# Altium project eecs373_driver_board_rev1.PrjPcb
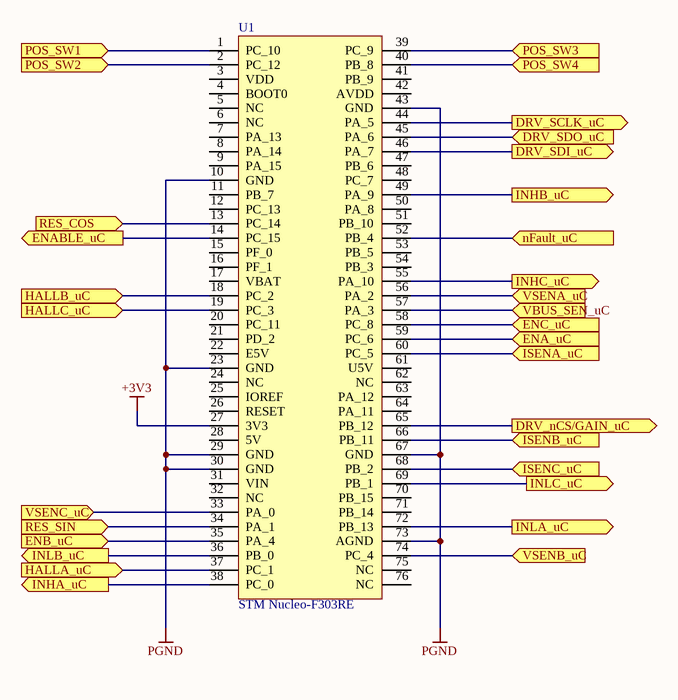
[diagram p0: 02-Nucleo_Breakout.SchDoc]
3 sheets, 107 parts. Net scope: hierarchical (ports join the sheet entries above them; power ports are global).
Board file: Driver_Board.PcbDoc
Sheets:
  02-Nucleo_Breakout.SchDoc
  03-Gate_Driver.SchDoc
  04-Power_Stage.SchDoc

## Sheet 02-Nucleo_Breakout.SchDoc
size B

### Parts
U1  STM Nucleo-F303RE  [Nucleo MORPHO CONNECTORS]

### Ports
DRV_nCS/GAIN_uC (out), DRV_SCLK_uC (out), DRV_SDI_uC (out), DRV_SDO_uC (in), ENA_uC (in), ENABLE_uC (out), ENB_uC (in), ENC_uC (in), HALLA_uC (in), HALLB_uC (in), HALLC_uC (in), INHA_uC (out), INHB_uC (out), INHC_uC (out), INLA_uC (out), INLB_uC (out), INLC_uC (out), ISENA_uC (in), ISENB_uC (in), ISENC_uC (in), nFault_uC (in), POS_SW1 (in), POS_SW2 (in), POS_SW3 (in), POS_SW4 (in), RES_COS (in), RES_SIN (in), VBUS_SEN_uC (in), VSENA_uC (in), VSENB_uC (in), VSENC_uC (in)

### Nets
+3V3: U1.27(3V3)  [project net VREF]
PGND: U1.10(GND) U1.23(GND) U1.29(GND) U1.30(GND) U1.43(GND) U1.67(GND) U1.73(AGND)
NetU1_1: U1.1(PC_10) ; port POS_SW1
NetU1_2: U1.2(PC_12) ; port POS_SW2
NetU1_13: U1.13(PC_14) ; port RES_COS
NetU1_14: U1.14(PC_15) ; port ENABLE_uC
NetU1_18: U1.18(PC_2) ; port HALLB_uC
NetU1_19: U1.19(PC_3) ; port HALLC_uC
NetU1_33: U1.33(PA_0) ; port VSENC_uC
NetU1_34: U1.34(PA_1) ; port RES_SIN
NetU1_35: U1.35(PA_4) ; port ENB_uC
NetU1_36: U1.36(PB_0) ; port INLB_uC
NetU1_37: U1.37(PC_1) ; port HALLA_uC
NetU1_38: U1.38(PC_0) ; port INHA_uC
NetU1_39: U1.39(PC_9) ; port POS_SW3
NetU1_40: U1.40(PB_8) ; port POS_SW4
NetU1_44: U1.44(PA_5) ; port DRV_SCLK_uC
NetU1_45: U1.45(PA_6) ; port DRV_SDO_uC
NetU1_46: U1.46(PA_7) ; port DRV_SDI_uC
NetU1_49: U1.49(PA_9) ; port INHB_uC
NetU1_52: U1.52(PB_4) ; port nFault_uC
NetU1_55: U1.55(PA_10) ; port INHC_uC
NetU1_56: U1.56(PA_2) ; port VSENA_uC
NetU1_57: U1.57(PA_3) ; port VBUS_SEN_uC
NetU1_58: U1.58(PC_8) ; port ENC_uC
NetU1_59: U1.59(PC_6) ; port ENA_uC
NetU1_60: U1.60(PC_5) ; port ISENA_uC
NetU1_65: U1.65(PB_12) ; port DRV_nCS/GAIN_uC
NetU1_66: U1.66(PB_11) ; port ISENB_uC
NetU1_68: U1.68(PB_2) ; port ISENC_uC
NetU1_69: U1.69(PB_1) ; port INLC_uC
NetU1_72: U1.72(PB_13) ; port INLA_uC
NetU1_74: U1.74(PC_4) ; port VSENB_uC

Not connected (* = marked no-connect by the designer): U1 3(VDD) 4(BOOT0) 5(NC) 6(NC) 7(PA_13) 8(PA_14) 9(PA_15) 11(PB_7) 12(PC_13) 15(PF_0) 16(PF_1) 17(VBAT) 20(PC_11) 21(PD_2) 22(E5V) 24(NC) 25(IOREF) 26(RESET) 28(5V) 31(VIN) 32(NC) 41(PB_9) 42(AVDD) 47(PB_6) 48(PC_7) 50(PA_8) 51(PB_10) 53(PB_5) 54(PB_3) 61(U5V) 62(NC) 63(PA_12) 64(PA_11) 70(PB_15) 71(PB_14) 75(NC) 76(NC)

## Sheet 03-Gate_Driver.SchDoc
size B
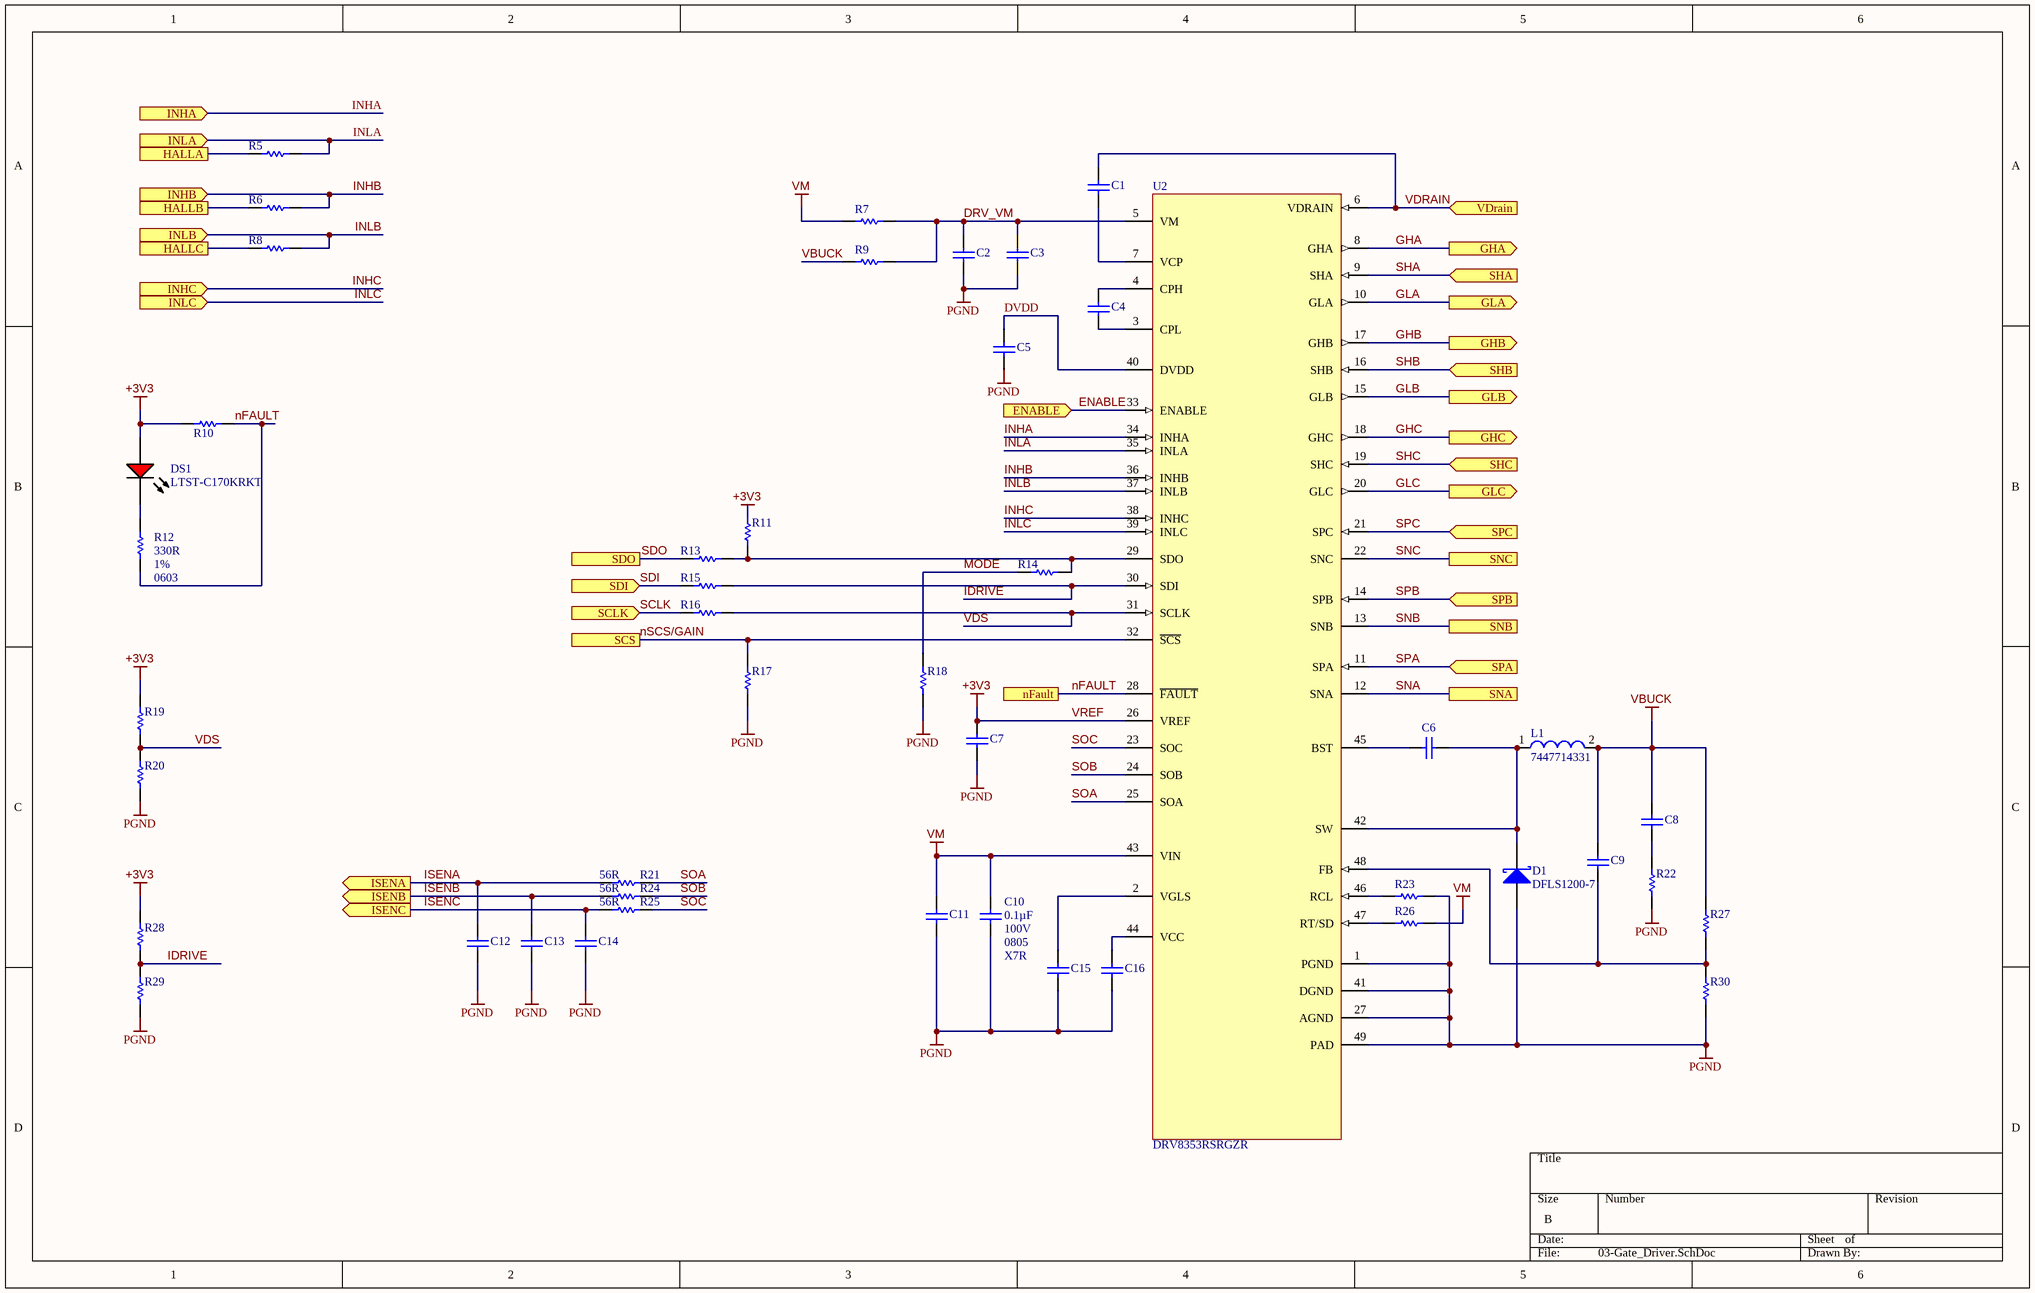
[diagram p1: 03-Gate_Driver.SchDoc]

### Parts
C1  GRM31CR72A105KA01L  [CAPC3216X180X55ML20T25]  (value not drawn)
C2  C5750X7S2A106M230KB  [TDK-C5750-2_L]  (value not drawn)
C3  C2012X7R2A104K125AA  [CAPC2013X145X20ML20]  (value not drawn)
C4  C0805C473K1RACTU  [CAPC2013X110X50LL20T25]  (value not drawn)
C5  C0603C105K4RACTU  [CAPC1608X90X35LL15T15]  (value not drawn)
C6  C0603C103K4RACTU  [CAPC1608X87X35ML15T15]  (value not drawn)
C7  C0603C104J4RACTU  [CAPC1608X87X35NL15T15]  (value not drawn)
C8  C2012X7R1H225K125AC  [CAPC2013X145X20LL20]  (value not drawn)
C9  GRM1885C1H362JA01D  [CAPC1608X90X35ML10T15]  (value not drawn)
C10  Temperature Coefficient: X7R  Voltage - Rated: 100V  Package Reference: 0805  Capacitance: 0.1µF  [CAPC2013X145X20ML20]  (hidden comment: C2012X7R2A104K125AA)
C11  C3216X7R2A105K160AA  [CAPC3216X180X20LL20]  (value not drawn)
C12  GRM188R71C222KA01D  [CAPC1608X90X35NL10T15]  (value not drawn)
C13  GRM188R71C222KA01D  [CAPC1608X90X35NL10T15]  (value not drawn)
C14  GRM188R71C222KA01D  [CAPC1608X90X35NL10T15]  (value not drawn)
C15  C0805C105K3RACTU  [CAPC2013X140X50LL20T25]  (value not drawn)
C16  C0603C105K4RACTU  [CAPC1608X90X35LL15T15]  (value not drawn)
D1  DFLS1200-7  [DIOD-POWERDI123-2_A_V]
DS1  LTST-C170KRKT  [LTST-C170KRKT_V]
L1  7447714331  [WE-PD 1050]
R5  ERJ-3GEY0R00V  [RESC1608X55X30NL15T15]  (value not drawn)
R6  ERJ-3GEY0R00V  [RESC1608X55X30NL15T15]  (value not drawn)
R7  ERJ-3GEY0R00V  [RESC1608X55X30NL15T15]  (value not drawn)
R8  ERJ-3GEY0R00V  [RESC1608X55X30NL15T15]  (value not drawn)
R9  ERJ-3GEY0R00V  [RESC1608X55X30NL15T15]  (value not drawn)
R10  RG1608P-103-B-T5  [RESC1608X50X30NL20T20]  (value not drawn)
R11  ERJ-3GEYJ102V  [RESC1608X55X30ML15T15]  (value not drawn)
R12  Case Code (Imperial): 0603  Tolerance: 1%  Resistance: 330R  [RESC1608X55X30NL15T15]  (hidden comment: ERJ3EKF3300V)
R13  ERJ-3GEY0R00V  [RESC1608X55X30NL15T15]  (value not drawn)
R14  ERJ-3GEY0R00V  [RESC1608X55X30NL15T15]  (value not drawn)
R15  ERJ-3GEY0R00V  [RESC1608X55X30NL15T15]  (value not drawn)
R16  ERJ-3GEY0R00V  [RESC1608X55X30NL15T15]  (value not drawn)
R17  CRCW060347K0JNEA  [RESC1609X50X30ML10T20]  (value not drawn)
R18  CRCW060347K0JNEA  [RESC1609X50X30ML10T20]  (value not drawn)
R19  CRCW060375K0JNEA  [RESC1609X50X30ML10T20]  (value not drawn)
R20  CRCW060375K0JNEA  [RESC1609X50X30ML10T20]  (value not drawn)
R21  Resistance: 56R  [RESC1609X50X30ML10T20]  (hidden comment: CRCW060356R0FKEA)
R22  2R61 1% 0603(1608)  [RESC0603(1608)_N]  (value not drawn)
R23  CRCW0603107KFKEA  [RESC1609X50X30LL10T20]  (value not drawn)
R24  Resistance: 56R  [RESC1609X50X30ML10T20]  (hidden comment: CRCW060356R0FKEA)
R25  Resistance: 56R  [RESC1609X50X30ML10T20]  (hidden comment: CRCW060356R0FKEA)
R26  ERJ-3EKF2743V  [RESC1608X55X30NL15T15]  (value not drawn)
R27  RG1608P-103-B-T5  [RESC1608X50X30NL20T20]  (value not drawn)
R28  CRCW060375K0JNEA  [RESC1609X50X30ML10T20]  (value not drawn)
R29  CRCW060375K0JNEA  [RESC1609X50X30ML10T20]  (value not drawn)
R30  RG1608P-2611-B-T5  [RESC1608X50X30NL20T20]  (value not drawn)
U2  DRV8353RSRGZR  [DRV8353RS]

### Ports
ENABLE (in), GHA (out), GHB (out), GHC (out), GLA (out), GLB (out), GLC (out), HALLA, HALLB, HALLC, INHA (in), INHB (in), INHC (in), INLA (in), INLB (in), INLC (in), ISENA (out), ISENB (out), ISENC (out), nFault, SCLK (in), SCS, SDI (in), SDO, SHA (in), SHB (in), SHC (in), SNA, SNB, SNC, SPA (in), SPB (in), SPC (in), VDrain (in)

### Nets
PGND: C2.1 C3.1 C5.1 C7.1 C10.1 C11.1 C12.1 C13.1 C14.1 C15.1 C16.1 D1.1(A) R17.1 R18.1 R20.2 R22.1 R23.2 R29.2 R30.1 U2.1(PGND) U2.27(AGND) U2.41(DGND) U2.49(PAD)
VBUCK: C8.2 C9.2 L1.2 R9.1 R27.2
VM: C10.2 C11.2 R7.1 R26.2 U2.43(VIN)
VREF: C7.2 DS1.1(A) R10.2 R11.2 R19.1 R28.1 U2.26(VREF)  [also labelled +3V3]
DRV_VM: C2.2 C3.2 R7.2 R9.2 U2.5(VM)
DVDD: C5.2 U2.40(DVDD)
ENABLE: U2.33(ENABLE) ; port ENABLE
GHA: U2.8(GHA) ; port GHA
GHB: U2.17(GHB) ; port GHB
GHC: U2.18(GHC) ; port GHC
GLA: U2.10(GLA) ; port GLA
GLB: U2.15(GLB) ; port GLB
GLC: U2.20(GLC) ; port GLC
IDRIVE: R15.2 R28.2 R29.1 U2.30(SDI)
INHA: U2.34(INHA) ; port INHA
INHB: R6.2 U2.36(INHB) ; port INHB
INHC: U2.38(INHC) ; port INHC
INLA: R5.2 U2.35(INLA) ; port INLA
INLB: R8.2 U2.37(INLB) ; port INLB
INLC: U2.39(INLC) ; port INLC
ISENA: C12.2 R21.1 ; port ISENA
ISENB: C13.2 R24.1 ; port ISENB
ISENC: C14.2 R25.1 ; port ISENC
MODE: R14.1 R18.2
nFAULT: R10.1 R12.1 U2.28(~{FAULT}) ; port nFault
nSCS/GAIN: R17.2 U2.32(~{SCS}) ; port SCS
SCLK: R16.1 ; port SCLK
SDI: R15.1 ; port SDI
SDO: R13.1 ; port SDO
SHA: U2.9(SHA) ; port SHA
SHB: U2.16(SHB) ; port SHB
SHC: U2.19(SHC) ; port SHC
SNA: U2.12(SNA) ; port SNA
SNB: U2.13(SNB) ; port SNB
SNC: U2.22(SNC) ; port SNC
SOA: R21.2 U2.25(SOA)
SOB: R24.2 U2.24(SOB)
SOC: R25.2 U2.23(SOC)
SPA: U2.11(SPA) ; port SPA
SPB: U2.14(SPB) ; port SPB
SPC: U2.21(SPC) ; port SPC
VDRAIN: C1.2 U2.6(VDRAIN) ; port VDrain
VDS: R16.2 R19.2 R20.1 U2.31(SCLK)
NetC1_1: C1.1 U2.7(VCP)
NetC4_1: C4.1 U2.3(CPL)
NetC4_2: C4.2 U2.4(CPH)
NetC6_1: C6.1 U2.45(BST)
NetC6_2: C6.2 D1.2(K) L1.1 U2.42(SW)
NetC8_1: C8.1 R22.2
NetC9_1: C9.1 R27.1 R30.2 U2.48(FB)
NetC15_2: C15.2 U2.2(VGLS)
NetC16_2: C16.2 U2.44(VCC)
NetDS1_2: DS1.2(K) R12.2
NetR5_1: R5.1 ; port HALLA
NetR6_1: R6.1 ; port HALLB
NetR8_1: R8.1 ; port HALLC
NetR11_1: R11.1 R13.2 R14.2 U2.29(SDO)
NetR23_1: R23.1 U2.46(RCL)
NetR26_1: R26.1 U2.47(RT/SD)

### Library data of the parts
C1 = CMP-2000-04948-1: Chip Capacitor, 1 uF, +/- 10%, 100 V, -55 to 125 degC, 1206 (3216 Metric), RoHS, Tape and Reel; Manufacturer: Murata; Catalog Drawings: GRMSeries_1206_1.6; Featured Product: GA3SafetyRecognizedCapsandHi-CapMLCC; Online Catalog: GRMSeries; Temperature Coefficient: X7R; Product Training Modules: High-CapMultilayerCeramicCapacitors; Other Names: 490-3909-6; Voltage - Rated: 100V; Capacitance: 1µF; Thickness (Max): 0.071"(1.80mm); Height - Seated (Max): -; Features: -; Applications: GeneralPurpose; Manufacturer URL: http://www.murata.com/; Standard Package: 1; Size / Dimension: 0.126"Lx0.063"W(3.20mmx1.60mm); Package Reference: 1206; Series: GRM; Package / Case: 1206(3216Metric); Datasheet Version: Sep-11; Ratings: -; Category: Capacitors; Datasheet URL: https://datasheet.ciiva.com/29199/454987-da-01-en-vs-kondensator-1206-29199435.pdf; Operating Temperature: -55degC~125degC; Lead Spacing: -; Family: CeramicCapacitors; Tolerance: ±10%; Packaging: Digi-Reel; Mounting Type: SurfaceMount,MLCC; Package Description: 2-Pin Surface Mount Device, Body 3.2 x 1.6 mm; Lead Style: -
C2 = CMP-2000-06059-1: Chip Capacitor, 10 uF, +/- 20%, 100 V, -55 to 125 degC, 2220 (5750 Metric), RoHS, Tape and Reel; PCN Part Number: MLCCPartNumberChange30/Nov/2012; Manufacturer: TDK; Other Names: 445-5212-1; Featured Product: Compact,High-CapacitanceMultilayerCeramicChipCapacitorsMidVoltageX7S-100VMLCCsC-SeriesMidVoltageMLCCs; Product Training Modules: SEAT,CCV,andTVCLDesignToolsCSeriesMidVoltageCapacitorsFamilyGuidetoReplacinganElectrolyticCapacitorwithanMLCC; Kits: 445-9009-KIT-ND-KITCAPCERHICAP100V-630VSMDSAMPLEKIT1008-ND-KITCAPCERMLCC100V-630V; Catalog Drawings: CSERIES_2220_2.5; Online Catalog: CSeries,MidVoltage; Temperature Coefficient: X7S; Voltage - Rated: 100V; Capacitance: 10µF; Package Description: SMD, 2-Leads, Body 6.1 x 5.4 mm; Manufacturer URL: http://www.tdk.com/; Size / Dimension: 0.224"Lx0.197"W(5.70mmx5.00mm); RoHS Information: RoHSCertificate-MLCC; Package Reference: C5750-2; Applications: GeneralPurpose; Datasheet Version: 09/2013; Features: -; Datasheet URL: https://datasheet.ciiva.com/24216/c5750x7s2a106m230kb-265716-24216594.pdf; Standard Package: 1; Lead Spacing: -; Family: CeramicCapacitors; Thickness (Max): 0.098"(2.50mm); Packaging: CutTape(CT); Mounting Technology: SurfaceMount; Lead Style: -; Height - Seated (Max): -; Package / Case: 2220(5750Metric); Series: C; Category: Capacitors; Ratings: -; Operating Temperature: -55°C~125°C; Mounting Type: SurfaceMount,MLCC; Tolerance: ±20%
C3 = CMP-2000-05453-1: Chip Capacitor, 100 nF, +/- 10%, 100 V, -55 to 1255 degC, 0805 (2012 Metric), RoHS, Tape and Reel; Manufacturer: TDK; PCN Part Number: MLCCPartNumberChange30/Nov/2012; Temperature Coefficient: X7R; Voltage - Rated: 100V; Kits: SAMPLEKIT1008-ND-KITCAPCERMLCC100V-630V; Other Names: 445-1418-1; Online Catalog: CSeries,MidVoltage; Featured Product: C-SeriesMidVoltageMLCCs; Catalog Drawings: CSERIES_2012-0805_1.45; Product Training Modules: HighCapacitanceReplacementSEAT,CCV,andTVCLDesignToolsGuidetoReplacinganElectrolyticCapacitorwithanMLCC; Capacitance: 0.1µF; Applications: GeneralPurpose; Datasheet Version: Jul-13; Mounting Type: SurfaceMount,MLCC; Height - Seated (Max): -; Packaging: CutTape(CT); Datasheet URL: https://datasheet.ciiva.com/11788/0900766b80fc5cba-11788142.pdf; Tolerance: ±10%; Package Reference: 805; Manufacturer URL: http://www.tdk.com/; Thickness (Max): 0.057"(1.45mm); Series: C; Lead Style: -; Operating Temperature: -55degC~125degC; Category: Capacitors; Package Description: 2-Pin Surface Mount Device, Body 2 x 1.25 mm; Standard Package: 1; Package / Case: 0805(2012Metric); Family: CeramicCapacitors; RoHS Information: RoHSCertificate-MLCC; Size / Dimension: 0.079"Lx0.049"W(2.00mmx1.25mm); Lead Spacing: -; Ratings: -; Features: -
C4 = CMP-2007-03657-1: Manufacturer: Kemet; Part Number: C0805C473K1RACTU
C5 C16 = CMP-2006-02240-1: Manufacturer: Kemet; Part Number: C0603C105K4RACTU
C6 = CMP-2006-03042-1: Manufacturer: Kemet; Part Number: C0603C103K4RACTU
C7 = CMP-2006-03054-1: Manufacturer: Kemet; Part Number: C0603C104J4RACTU
C8 = CMP-2000-06040-1: Chip Capacitor, 2.2 uF, +/- 10%, 50 V, -55 to 125 degC, 0805 (2012 Metric), RoHS, Tape and Reel; Manufacturer: TDK; PCN Part Number: MLCCPartNumberChange30/Nov/2012; Other Names: 445-5968-1; Temperature Coefficient: X7R; Catalog Drawings: CSERIES_2012-0805_1.45; Kits: 445-9015-KIT-ND-KITMLCC1000PF-47UF080510-50V445-9003-KIT-ND-KITCAPCERHICAPMLCCSMD445-173086-KIT-ND-C0402-2220X7R6.3-50V1,000PF-; Online Catalog: CSeries,GeneralPurpose; Voltage - Rated: 50V; Capacitance: 2.2µF; Product Training Modules: CSeriesGeneralApplicationsSEAT,CCV,andTVCLDesignToolsGuidetoReplacinganElectrolyticCapacitorwithanMLCC; Operating Temperature: -55°C~125°C; Features: -; Tolerance: ±10%; Datasheet URL: https://datasheet.ciiva.com/24216/c2012x7r1h225k125ac-265016-24216364.pdf; Lead Style: -; Size / Dimension: 0.079"Lx0.049"W(2.00mmx1.25mm); Mounting Technology: SurfaceMount; Package Reference: 0805; Thickness (Max): 0.057"(1.45mm); RoHS Information: RoHSCertificate-MLCC; Height - Seated (Max): -; Manufacturer URL: http://www.tdk.com/; Standard Package: 1; Category: Capacitors; Package Description: 2-Pin Surface Mount Device, Body 2 x 1.25 mm; Packaging: CutTape(CT); Series: C; Applications: GeneralPurpose; Package / Case: 0805(2012Metric); Ratings: -; Datasheet Version: 09/2013; Family: CeramicCapacitors; Mounting Type: SurfaceMount,MLCC; Lead Spacing: -
C9 = CMP-2006-02551-1: Manufacturer: Murata; Part Number: GRM1885C1H362JA01D
C10 = CMP-2000-05453-1: Chip Capacitor, 100 nF, +/- 10%, 100 V, -55 to 1255 degC, 0805 (2012 Metric), RoHS, Tape and Reel; Manufacturer: TDK; PCN Part Number: MLCCPartNumberChange30/Nov/2012; Kits: SAMPLEKIT1008-ND-KITCAPCERMLCC100V-630V; Other Names: 445-1418-1; Online Catalog: CSeries,MidVoltage; Featured Product: C-SeriesMidVoltageMLCCs; Catalog Drawings: CSERIES_2012-0805_1.45; Product Training Modules: HighCapacitanceReplacementSEAT,CCV,andTVCLDesignToolsGuidetoReplacinganElectrolyticCapacitorwithanMLCC; Applications: GeneralPurpose; Datasheet Version: Jul-13; Mounting Type: SurfaceMount,MLCC; Height - Seated (Max): -; Packaging: CutTape(CT); Datasheet URL: https://datasheet.ciiva.com/11788/0900766b80fc5cba-11788142.pdf; Tolerance: ±10%; Manufacturer URL: http://www.tdk.com/; Thickness (Max): 0.057"(1.45mm); Series: C; Lead Style: -; Operating Temperature: -55degC~125degC; Category: Capacitors; Package Description: 2-Pin Surface Mount Device, Body 2 x 1.25 mm; Standard Package: 1; Package / Case: 0805(2012Metric); Family: CeramicCapacitors; RoHS Information: RoHSCertificate-MLCC; Size / Dimension: 0.079"Lx0.049"W(2.00mmx1.25mm); Lead Spacing: -; Ratings: -; Features: -
C11 = CMP-2000-06049-1: Chip Capacitor, 1 uF, +/- 10%, 100 V, -55 to 125 degC, 1206 (3216 Metric), RoHS, Tape and Reel; Manufacturer: TDK; PCN Part Number: MLCCPartNumberChange30/Nov/2012; Kits: SAMPLEKIT1008-ND-KITCAPCERMLCC100V-630V; Product Training Modules: SEAT,CCV,andTVCLDesignToolsGuidetoReplacinganElectrolyticCapacitorwithanMLCC; Capacitance: 1µF; Featured Product: C-SeriesMidVoltageMLCCs; Voltage - Rated: 100V; Other Names: 445-4467-1; Catalog Drawings: CSERIES_1206_1.8; Online Catalog: CSeries,MidVoltage; Temperature Coefficient: X7R; Features: -; Family: CeramicCapacitors; Datasheet URL: http://www.farnell.com/datasheets/1484596.pdf; Mounting Technology: SurfaceMount; Mounting Type: SurfaceMount,MLCC; Datasheet Version: 08/2011; Standard Package: 1; Package / Case: 1206(3216Metric); Thickness (Max): 0.051"(1.30mm); Size / Dimension: 0.126"Lx0.063"W(3.20mmx1.60mm); Applications: GeneralPurpose; Package Reference: 1206; Operating Temperature: -55°C~125°C; Packaging: CutTape(CT); Package Description: 2-Pin Surface Mount Device, Body 3.2 x 1.6 mm; Ratings: -; Series: C; Tolerance: ±10%; Manufacturer URL: http://www.tdk.com/; Lead Spacing: -; Height - Seated (Max): -; Package URL: https://product.tdk.com/info/en/documents/chara_sheet/C3216X7R1V106K160AC.pdf; Lead Style: -; Category: Capacitors; RoHS Information: RoHSCertificate-MLCC
C12-C14 = CMP-2006-02517-1: Manufacturer: Murata; Part Number: GRM188R71C222KA01D
C15 = CMP-2007-03234-1: Manufacturer: Kemet; Part Number: C0805C105K3RACTU
D1 = CMP-2000-07540-1: High Voltage Schottky Barrier Rectifier, 200 V, 1 A, -65 to 175 degC, 2-Pin SMD, RoHS, Tape and Reel; Manufacturer: Diodes Inc; Peak Non-Repetitive Surge Current: 40A; Max Repetitive Reverse Voltage (Vrrm): 200V; Peak Reverse Current: 2uA; Capacitance: 23pF; Forward Current: 1A; Forward Voltage: 850mV; Element Configuration: Single; Polarity: Standard; Number of Pins: 2; Package Description: 2-Pin Small Outline Diode, Body 2.8 x 1.78 mm; Mount: SurfaceMount; Max Operating Temperature: 150degC; Package Quantity: 3000; Lead Free: LeadFree; Max Forward Surge Current (Ifsm): 40A; Height: 0.98mm; Datasheet Version: Rev. 6-2, 10/2008; Package Reference: POWERDI123-2_A; Reverse Voltage (DC): 200V; REACH SVHC: NoSVHC; Min Operating Temperature: -65degC; RoHSCompliant: true; Width: 1.78mm; Contact Plating: Matte; Termination: SMD/SMT; Manufacturer URL: http://www.diodes.com/; Voltage Rating (DC): 200V; Length: 2.8mm; Output Current: 1A; Packaging: TapeandReel; Current Rating: 1A; Radiation Hardening: No; Mounting Technology: SurfaceMount; Average Rectified Current: 1A; Datasheet URL: https://www.diodes.com/assets/Datasheets/ds30628.pdf
DS1 = CMP-2000-07593-1: LED Red, 75 mW, 54 mcd, -55 to 85 degC, 2-Pin SMD, RoHS, Tape and Reel; Manufacturer: Lite-On; Lens Transparency: Clear; Number of Elements: 1; Power Rating: 75mW; Luminous Intensity: 54mcd; Viewing Angle: 130degrees; Forward Current: 30mA; Wavelength: 639nm; Lens Style: Rectangular; Case\/Package: 0805; Test Current: 20mA; Dominant Wavelength: 631nm; Forward Voltage: 2V; Lens Colour: Colorless; Min Operating Temperature: -55degC; RoHSCompliant: True; Length: 3.2mm; Width: 1.25mm; Mount: SurfaceMount; Packaging: TapeandReel; Number of LEDs: 1; Radiation Hardening: No; Datasheet URL: http://optoelectronics.liteon.com/upload/download/DS-22-99-0150/LTST-C170KRKT.pdf; Datasheet Version: Rev. D, 11/2014; Case Code (Metric): 2012; Height: 1.1mm; Number of Pins: 2; Package Description: 2-Pin Surface Mount Device, Body 2 x 1.25 mm; Manufacturer URL: http://www.us.liteon.com/; Lead Free: LeadFree; Illumination Colour: Red; Colour: Red; Case Code (Imperial): 0805; Max Operating Temperature: 85degC; Power Dissipation: 75mW; Mounting Technology: SurfaceMount; Package Reference: C170KRKT; Package Quantity: 1; Depth: 1.6mm
L1 = CMP-1396-00019-1: SMD-Shielded Power Inductor WE-PD, L=330 µH; Manufacturer: Wuerth Elektronik; Inductance: 330 ÂµH; PackageReference: WE-PD 1050; ComponentLink1URL: http://www.we-online.com; ComponentLink1Description: Manufacturer URL; ComponentLink2Description: Datasheet; PartNumber: 7447714331; ComponentLink2URL: http://www.we-online.de/katalog/media/pdf/7447714331.pdf
R5-R9 R13-R16 = CMP-2000-00700-1: Manufacturer: Panasonic; Part Number: ERJ-3GEY0R00V
R10 R27 = CMP-2000-01968-1: Manufacturer: Susumu; Part Number: RG1608P-103-B-T5
R11 = CMP-2000-00703-1: Manufacturer: Panasonic; Part Number: ERJ-3GEYJ102V
R12 = CMP-2000-00435-1: Manufacturer: Panasonic; Power Rating: 100mW; Voltage Rating: 75V; Temperature Coefficient: 100ppm/°C; Part Number: ERJ3EKF3300V; Supplier 1: Newark; Supplier Part Number 1: 85Y8676; Manufacturer Part Number: ERJ3EKF3300V; Stock 1: 0; RoHS: Yes; Mount: Surface Mount; Case/Package: 0603; Number of Pins: 2; Weight: 7.1E-05oz; Case Code (Metric): 1608; Contact Plating: Tin; Min Operating Temperature: -55°C; Max Operating Temperature: 155°C; Packaging: Tape and Reel; Composition: Thick Film; Package Quantity: 5000; Military Standard: Not; Termination: SMD/SMT; Number of Terminations: 2; Max Power Dissipation: 100mW; Voltage Rating (DC): 75V; Features: Automotive AEC-Q200; Length: 1.6mm; Height: 0.45mm; Width: 0.8mm; Depth: 0.8mm; Radiation Hardening: No; REACH SVHC: No SVHC; Lead Free: Lead Free; ComponentLink1URL: https://datasheet.ciiva.com/7886/aoa0000ce2-7886729.pdf?src-supplier=Element14; ComponentLink1Description: https://datasheet.ciiva.com/7886/aoa0000ce2-7886729.pdf?src-supplier=Element14; ComponentLink2URL: https://datasheet.ciiva.com/48531/aoa0000ce2-48531001.pdf?src-supplier=Avnet; ComponentLink2Description: https://datasheet.ciiva.com/48531/aoa0000ce2-48531001.pdf?src-supplier=Avnet; ComponentLink3URL: https://datasheet.ciiva.com/22721/426256-22721099.pdf?src-supplier=Element14; ComponentLink3Description: https://datasheet.ciiva.com/22721/426256-22721099.pdf?src-supplier=Element14; ComponentLink4URL: https://datasheet.ciiva.com/46373/1678782-46373899.pdf?src-supplier=Element14; ComponentLink4Description: https://datasheet.ciiva.com/46373/1678782-46373899.pdf?src-supplier=Element14; ComponentLink5URL: https://datasheet.ciiva.com/9117/aoa0000ce2-9117132.pdf?src-supplier=Avnet; ComponentLink5Description: https://datasheet.ciiva.com/9117/aoa0000ce2-9117132.pdf?src-supplier=Avnet; ComponentLink6URL: https://datasheet.ciiva.com/46373/1678782-46373900.pdf?src-supplier=Element14; ComponentLink6Description: https://datasheet.ciiva.com/46373/1678782-46373900.pdf?src-supplier=Element14
R17 R18 = CMP-2000-03381-1: Manufacturer: Vishay Dale; Part Number: CRCW060347K0JNEA
R19 R20 R28 R29 = CMP-2000-03572-1: Manufacturer: Vishay Dale; Part Number: CRCW060375K0JNEA
R21 R24 R25 = CMP-2000-03471-1: Manufacturer: Vishay Dale; Tolerance: 1%; Power Rating: 100mW; Voltage Rating: 75V; Temperature Coefficient: 100ppm/°C; Part Number: CRCW060356R0FKEA; Supplier 1: Future Electronics; Supplier Part Number 1: CRCW060356R0FKEA-CUTT; Manufacturer Part Number: CRCW060356R0FKEA; Stock 1: 319717; Pricing 1: 1=0.09800, 250=0.00660, 750=0.00620, 1500=0.00590, 2500=0.00580 (USD); RoHS: Yes; Case/Package: 0603; Number of Pins: 2; Weight: 7.1E-05oz; Case Code (Imperial): 0603; Case Code (Metric): 1608; Contact Plating: Tin; Min Operating Temperature: -55°C; Max Operating Temperature: 155°C; Packaging: Tape and Reel; Composition: Thick Film; Package Quantity: 10; Number of Terminations: 2; Max Power Dissipation: 100mW; Military Standard: Not; Voltage Rating (DC): 75V; Termination: SMD/SMT; Features: Automotive AEC-Q200; Length: 1.55mm; Height: 0.45mm; Width: 0.85mm; Depth: 0.85mm; Radiation Hardening: No; REACH SVHC: Unknown; Lead Free: Lead Free; ComponentLink1URL: https://datasheet.ciiva.com/11810/0900766b80d98afc-11810033.pdf?src-supplier=RSComponents; ComponentLink1Description: https://datasheet.ciiva.com/11810/0900766b80d98afc-11810033.pdf?src-supplier=RSComponents; ComponentLink2URL: https://datasheet.ciiva.com/7672/1697337-7672917.pdf?src-supplier=Element14; ComponentLink2Description: https://datasheet.ciiva.com/7672/1697337-7672917.pdf?src-supplier=Element14; ComponentLink3URL: https://datasheet.ciiva.com/16883/dcrcwe3-16883910.pdf?src-supplier=Avnet+Europe; ComponentLink3Description: https://datasheet.ciiva.com/16883/dcrcwe3-16883910.pdf?src-supplier=Avnet+Europe; ComponentLink4URL: https://datasheet.ciiva.com/2465/dcrcwe3-2465642.pdf?src-supplier=Digi-Key; ComponentLink4Description: https://datasheet.ciiva.com/2465/dcrcwe3-2465642.pdf?src-supplier=Digi-Key; ComponentLink5URL: https://datasheet.ciiva.com/16507/dcrcw-16507994.pdf?src-supplier=Future+Electronics; ComponentLink5Description: https://datasheet.ciiva.com/16507/dcrcw-16507994.pdf?src-supplier=Future+Electronics; ComponentLink6URL: https://datasheet.ciiva.com/16785/70201119-16785354.pdf?src-supplier=Allied+Electronics; ComponentLink6Description: https://datasheet.ciiva.com/16785/70201119-16785354.pdf?src-supplier=Allied+Electronics; ComponentLink7URL: https://datasheet.ciiva.com/2465/dcrcwe3-2465643.pdf?src-supplier=Digi-Key; ComponentLink7Description: https://datasheet.ciiva.com/2465/dcrcwe3-2465643.pdf?src-supplier=Digi-Key; ComponentLink8URL: https://datasheet.ciiva.com/3257/dcrcwe3-3257739.pdf?src-supplier=Avnet; ComponentLink8Description: https://datasheet.ciiva.com/3257/dcrcwe3-3257739.pdf?src-supplier=Avnet; ComponentLink9URL: https://datasheet.ciiva.com/22704/1697337-22704443.pdf?src-supplier=Element14; ComponentLink9Description: https://datasheet.ciiva.com/22704/1697337-22704443.pdf?src-supplier=Element14; ComponentLink10URL: https://datasheet.ciiva.com/2465/dcrcwe3-2465644.pdf?src-supplier=Digi-Key; ComponentLink10Description: https://datasheet.ciiva.com/2465/dcrcwe3-2465644.pdf?src-supplier=Digi-Key; ComponentLink11URL: https://datasheet.ciiva.com/3257/dcrcwe3-3257740.pdf?src-supplier=Avnet; ComponentLink11Description: https://datasheet.ciiva.com/3257/dcrcwe3-3257740.pdf?src-supplier=Avnet
R22 = CMP-1012-00216-1: 2R61 0.1W 1% 0603 (1608 Metric)  SMD; Case-EIA: 0603; Case-Metric: 1608; Value: 2.61 Ohm; Power: 0.1 W; Tolerance: 1 %; Technology: SMT
R23 = CMP-2000-03834-1: Manufacturer: Vishay Dale; Part Number: CRCW0603107KFKEA
R26 = CMP-2000-00395-1: Manufacturer: Panasonic; Part Number: ERJ-3EKF2743V
R30 = CMP-2000-02148-1: Manufacturer: Susumu; Part Number: RG1608P-2611-B-T5

## Sheet 04-Power_Stage.SchDoc
size B
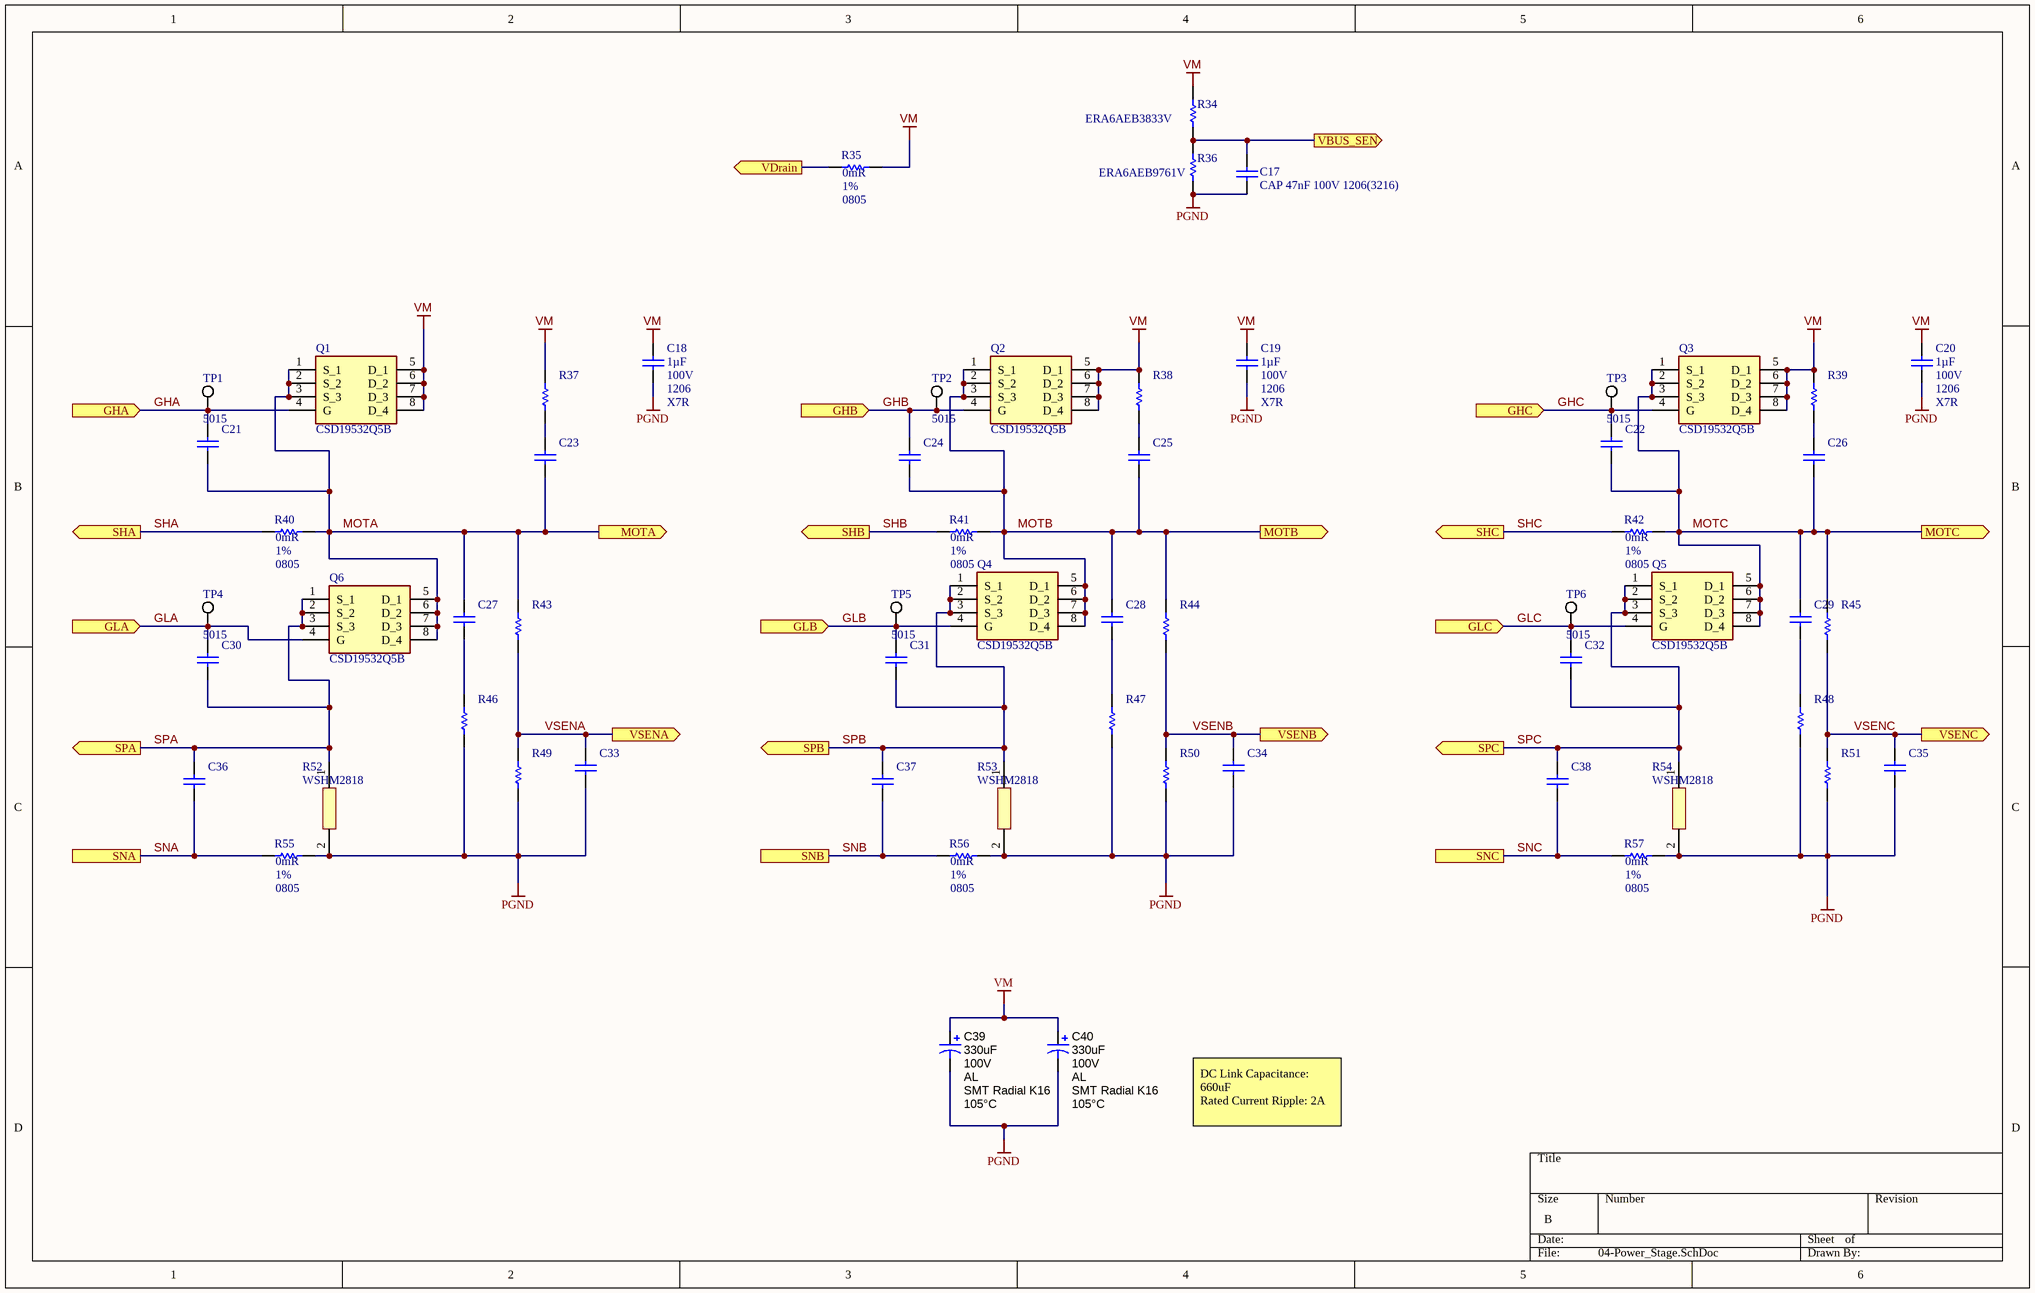
[diagram p2: 04-Power_Stage.SchDoc]

### Parts
C17  CAP 47nF 100V 1206(3216)  [CAPC1206(3216)170_N]
C18  Capacitance: 1µF  Package Reference: 1206  Voltage - Rated: 100V  Temperature Coefficient: X7R  [CAPC3216X180X20LL20]  (hidden comment: C3216X7R2A105K160AA)
C19  Capacitance: 1µF  Package Reference: 1206  Voltage - Rated: 100V  Temperature Coefficient: X7R  [CAPC3216X180X20LL20]  (hidden comment: C3216X7R2A105K160AA)
C20  Capacitance: 1µF  Package Reference: 1206  Voltage - Rated: 100V  Temperature Coefficient: X7R  [CAPC3216X180X20LL20]  (hidden comment: C3216X7R2A105K160AA)
C21  GRM188R72A222KA01D  [CAPC1608X90X35NL10T15]  (value not drawn)
C22  GRM188R72A222KA01D  [CAPC1608X90X35NL10T15]  (value not drawn)
C23  GRM188R72A222KA01D  [CAPC1608X90X35NL10T15]  (value not drawn)
C24  GRM188R72A222KA01D  [CAPC1608X90X35NL10T15]  (value not drawn)
C25  GRM188R72A222KA01D  [CAPC1608X90X35NL10T15]  (value not drawn)
C26  GRM188R72A222KA01D  [CAPC1608X90X35NL10T15]  (value not drawn)
C27  GRM188R72A222KA01D  [CAPC1608X90X35NL10T15]  (value not drawn)
C28  GRM188R72A222KA01D  [CAPC1608X90X35NL10T15]  (value not drawn)
C29  GRM188R72A222KA01D  [CAPC1608X90X35NL10T15]  (value not drawn)
C30  GRM188R72A222KA01D  [CAPC1608X90X35NL10T15]  (value not drawn)
C31  GRM188R72A222KA01D  [CAPC1608X90X35NL10T15]  (value not drawn)
C32  GRM188R72A222KA01D  [CAPC1608X90X35NL10T15]  (value not drawn)
C33  06033C473JAT2A  [CAPC1608X90X35NL15T15]  (value not drawn)
C34  06033C473JAT2A  [CAPC1608X90X35NL15T15]  (value not drawn)
C35  06033C473JAT2A  [CAPC1608X90X35NL15T15]  (value not drawn)
C36  0603YC102KAT2A  [CAPC1608X90X35NL15T15]  (value not drawn)
C37  0603YC102KAT2A  [CAPC1608X90X35NL15T15]  (value not drawn)
C38  0603YC102KAT2A  [CAPC1608X90X35NL15T15]  (value not drawn)
C39  TaMax_C: 105°C  PackageReference: SMT Radial K16  VDC_V: 100V  Technology: AL  ValueDisplayed: 330uF  [SM_RADIAL_K16]  (hidden comment: EEV-FK2A331M)
C40  TaMax_C: 105°C  PackageReference: SMT Radial K16  VDC_V: 100V  Technology: AL  ValueDisplayed: 330uF  [SM_RADIAL_K16]  (hidden comment: EEV-FK2A331M)
Q1  CSD19532Q5B  [Q5B]
Q2  CSD19532Q5B  [Q5B]
Q3  CSD19532Q5B  [Q5B]
Q4  CSD19532Q5B  [Q5B]
Q5  CSD19532Q5B  [Q5B]
Q6  CSD19532Q5B  [Q5B]
R34  ERA6AEB3833V  [RESC2013X60X40LL20T25]
R35  Case Code (Imperial): 0805  Resistance: 0mR  Tolerance: 1%  [RESC2013X50X30LL20T20]  (hidden comment: CRCW08050000Z0EA)
R36  ERA6AEB9761V  [RESC2013X60X40NL20T25]
R37  CRCW08052R70JNEA  [RESC2013X50X30NL20T20]  (value not drawn)
R38  CRCW08052R70JNEA  [RESC2013X50X30NL20T20]  (value not drawn)
R39  CRCW08052R70JNEA  [RESC2013X50X30NL20T20]  (value not drawn)
R40  Case Code (Imperial): 0805  Resistance: 0mR  Tolerance: 1%  [RESC2013X50X30LL20T20]  (hidden comment: CRCW08050000Z0EA)
R41  Case Code (Imperial): 0805  Resistance: 0mR  Tolerance: 1%  [RESC2013X50X30LL20T20]  (hidden comment: CRCW08050000Z0EA)
R42  Case Code (Imperial): 0805  Resistance: 0mR  Tolerance: 1%  [RESC2013X50X30LL20T20]  (hidden comment: CRCW08050000Z0EA)
R43  CRCW0603383KFKEA  [RESC1609X50X30ML10T20]  (value not drawn)
R44  CRCW0603383KFKEA  [RESC1609X50X30ML10T20]  (value not drawn)
R45  CRCW0603383KFKEA  [RESC1609X50X30ML10T20]  (value not drawn)
R46  CRCW08052R70JNEA  [RESC2013X50X30NL20T20]  (value not drawn)
R47  CRCW08052R70JNEA  [RESC2013X50X30NL20T20]  (value not drawn)
R48  CRCW08052R70JNEA  [RESC2013X50X30NL20T20]  (value not drawn)
R49  RC0603FR-079K76L  [RESC1608X55X25NL10T15]  (value not drawn)
R50  RC0603FR-079K76L  [RESC1608X55X25NL10T15]  (value not drawn)
R51  RC0603FR-079K76L  [RESC1608X55X25NL10T15]  (value not drawn)
R52  WSHM2818  [PCBComponent_1]
R53  WSHM2818  [PCBComponent_1]
R54  WSHM2818  [PCBComponent_1]
R55  Case Code (Imperial): 0805  Resistance: 0mR  Tolerance: 1%  [RESC2013X50X30LL20T20]  (hidden comment: CRCW08050000Z0EA)
R56  Case Code (Imperial): 0805  Resistance: 0mR  Tolerance: 1%  [RESC2013X50X30LL20T20]  (hidden comment: CRCW08050000Z0EA)
R57  Case Code (Imperial): 0805  Resistance: 0mR  Tolerance: 1%  [RESC2013X50X30LL20T20]  (hidden comment: CRCW08050000Z0EA)
TP1  5015  [KSTN-5015_V]
TP2  5015  [KSTN-5015_V]
TP3  5015  [KSTN-5015_V]
TP4  5015  [KSTN-5015_V]
TP5  5015  [KSTN-5015_V]
TP6  5015  [KSTN-5015_V]

### Ports
GHA (in), GHB (in), GHC (in), GLA (in), GLB (in), GLC (in), MOTA (out), MOTB (out), MOTC (out), SHA (out), SHB (out), SHC (out), SNA, SNB, SNC, SPA (out), SPB (out), SPC (out), VBUS_SEN (out), VDrain (out), VSENA (out), VSENB (out), VSENC (out)

### Nets
PGND: C17.1 C18.1 C19.1 C20.1 C33.1 C34.1 C35.1 C39.2(-) C40.2(-) R36.1 R46.1 R47.1 R48.1 R49.2 R50.2 R51.2 R52.2 R53.2 R54.2 R55.2 R56.2 R57.2
VM: C18.2 C19.2 C20.2 C39.1(+) C40.1(+) Q1.5(D_1) Q1.6(D_2) Q1.7(D_3) Q1.8(D_4) Q2.5(D_1) Q2.6(D_2) Q2.7(D_3) Q2.8(D_4) Q3.5(D_1) Q3.6(D_2) Q3.7(D_3) Q3.8(D_4) R34.2 R35.2 R37.2 R38.2 R39.2
GHA: C21.2 Q1.4(G) TP1.1 ; port GHA
GHB: C24.2 Q2.4(G) TP2.1 ; port GHB
GHC: C22.2 Q3.4(G) TP3.1 ; port GHC
GLA: C30.2 Q6.4(G) TP4.1 ; port GLA
GLB: C31.2 Q4.4(G) TP5.1 ; port GLB
GLC: C32.2 Q5.4(G) TP6.1 ; port GLC
MOTA: C21.1 C23.1 C27.2 Q1.1(S_1) Q1.2(S_2) Q1.3(S_3) Q6.5(D_1) Q6.6(D_2) Q6.7(D_3) Q6.8(D_4) R40.2 R43.2 ; port MOTA
MOTB: C24.1 C25.1 C28.2 Q2.1(S_1) Q2.2(S_2) Q2.3(S_3) Q4.5(D_1) Q4.6(D_2) Q4.7(D_3) Q4.8(D_4) R41.2 R44.2 ; port MOTB
MOTC: C22.1 C26.1 C29.2 Q3.1(S_1) Q3.2(S_2) Q3.3(S_3) Q5.5(D_1) Q5.6(D_2) Q5.7(D_3) Q5.8(D_4) R42.2 R45.2 ; port MOTC
SHA: R40.1 ; port SHA
SHB: R41.1 ; port SHB
SHC: R42.1 ; port SHC
SNA: C36.1 R55.1 ; port SNA
SNB: C37.1 R56.1 ; port SNB
SNC: C38.1 R57.1 ; port SNC
SPA: C30.1 C36.2 Q6.1(S_1) Q6.2(S_2) Q6.3(S_3) R52.1 ; port SPA
SPB: C31.1 C37.2 Q4.1(S_1) Q4.2(S_2) Q4.3(S_3) R53.1 ; port SPB
SPC: C32.1 C38.2 Q5.1(S_1) Q5.2(S_2) Q5.3(S_3) R54.1 ; port SPC
VSENA: C33.2 R43.1 R49.1 ; port VSENA
VSENB: C34.2 R44.1 R50.1 ; port VSENB
VSENC: C35.2 R45.1 R51.1 ; port VSENC
NetC17_2: C17.2 R34.1 R36.2 ; port VBUS_SEN
NetC23_2: C23.2 R37.1
NetC25_2: C25.2 R38.1
NetC26_2: C26.2 R39.1
NetC27_1: C27.1 R46.2
NetC28_1: C28.1 R47.2
NetC29_1: C29.1 R48.2
NetR35_1: R35.1 ; port VDrain

### Notes on the sheet
- DC Link Capacitance:
  660uF
  Rated Current Ripple: 2A

### Library data of the parts
C17 = CMP-1037-03996-1: CAP 47nF 100V ±10% 1206 (3216 Metric) Thickness 1.7mm SMD; Tolerance: Â±10%; Case-EIA: 1206; Case-Metric: 3216; Value: 47nF; Max Thickness: 1.7 mm; Technology: SMT; Rated Voltage: 100 V
C18-C20 = CMP-2000-06049-1: Chip Capacitor, 1 uF, +/- 10%, 100 V, -55 to 125 degC, 1206 (3216 Metric), RoHS, Tape and Reel; Manufacturer: TDK; PCN Part Number: MLCCPartNumberChange30/Nov/2012; Kits: SAMPLEKIT1008-ND-KITCAPCERMLCC100V-630V; Product Training Modules: SEAT,CCV,andTVCLDesignToolsGuidetoReplacinganElectrolyticCapacitorwithanMLCC; Featured Product: C-SeriesMidVoltageMLCCs; Other Names: 445-4467-1; Catalog Drawings: CSERIES_1206_1.8; Online Catalog: CSeries,MidVoltage; Features: -; Family: CeramicCapacitors; Datasheet URL: http://www.farnell.com/datasheets/1484596.pdf; Mounting Technology: SurfaceMount; Mounting Type: SurfaceMount,MLCC; Datasheet Version: 08/2011; Standard Package: 1; Package / Case: 1206(3216Metric); Thickness (Max): 0.051"(1.30mm); Size / Dimension: 0.126"Lx0.063"W(3.20mmx1.60mm); Applications: GeneralPurpose; Operating Temperature: -55°C~125°C; Packaging: CutTape(CT); Package Description: 2-Pin Surface Mount Device, Body 3.2 x 1.6 mm; Ratings: -; Series: C; Tolerance: ±10%; Manufacturer URL: http://www.tdk.com/; Lead Spacing: -; Height - Seated (Max): -; Package URL: https://product.tdk.com/info/en/documents/chara_sheet/C3216X7R1V106K160AC.pdf; Lead Style: -; Category: Capacitors; RoHS Information: RoHSCertificate-MLCC
C21-C32 = CMP-2006-02476-1: Manufacturer: Murata; Part Number: GRM188R72A222KA01D
C33-C35 = CMP-2006-04183-1: Manufacturer: AVX Interconnect / Elco; Part Number: 06033C473JAT2A
C36-C38 = CMP-2006-04486-1: Manufacturer: AVX Interconnect / Elco; Part Number: 0603YC102KAT2A
C39 C40 = CMP-0011224-2: CAP, AL, 330 uF, 100 V, +/- 20%, 0.153 ohm, AEC-Q200 Grade 2, SMD; Manufacturer: Panasonic; TaMin_C: -55°C; ESR_ohm: 1.53d; Polarized: Y; SizeAreaWB_mm2: 483; U/M: EA; Value: 330uF; SizeZ_mm: 16.5; SizeX_mm: 21; SizeY_mm: 19; Cap_Case: K16; SizeArea_mm2: 399; CompType: Capacitor; Cap_F: 330µF; IRMS_A: 9.17dA; AEC Grade: 2; AEC Category: Q200; Supplier Part Number 2: 667-EEV-FK2A331M; Publisher: Texas Instruments; Supplier 2: Mouser; RoHS: Y; Value1: 0.153 ohm; MountType: SMT; Supplier 1: Digi-Key; Tolerance_%: 20%; Value2: 100V; LatestRevisionDate: 2017-03-09; PartNumber: EEV-FK2A331M; AEC Qualified: Y; Series: FK; ComponentLink1Description: Datasheet link; Supplier Part Number 1: PCE3505CT-ND; ComponentLink1URL: https://industrial.panasonic.com/cdbs/www-data/pdf/RDE0000/ABA0000C1181.pdf
Q1-Q6 = CSD19532Q5B: Transistor; Manufacturer_Name: Texas Instruments; Datasheet Link: http://www.ti.com/lit/gpn/csd19532q5b; Manufacturer_Part_Number: CSD19532Q5B; Mouser Part Number: 595-CSD19532Q5B; Mouser Price/Stock: https://www.mouser.com/Search/Refine.aspx?Keyword=595-CSD19532Q5B
R34 = CMP-2001-00814-1: Manufacturer: Panasonic; Part Number: ERA6AEB3833V
R35 R40-R42 R55-R57 = CMP-2001-04896-1: Manufacturer: Vishay Dale; Power Rating: 125mW; Voltage Rating: 150V; Temperature Coefficient: 100ppm/°C; Part Number: CRCW08050000Z0EA; Supplier 1: Digi-Key; Supplier Part Number 1: 541-0.0ACT-ND; Manufacturer Part Number: CRCW08050000Z0EA; Stock 1: 236690; Pricing 1: 1=0.10000, 10=0.04400, 25=0.03160, 50=0.02420, 100=0.01780, 250=0.01360, 500=0.01090, 1000=0.00802 (USD); RoHS: Yes; Case/Package: 0805; Weight: 0.000194oz; Case Code (Metric): 2012; Contact Plating: Tin,Lead; Min Operating Temperature: -55°C; Max Operating Temperature: 155°C; Packaging: Tape and Reel; Composition: Thick Film; Number of Terminations: 2; Max Power Dissipation: 125mW; Package Quantity: 1; Termination: SMD/SMT; Military Standard: Not; Voltage Rating (DC): 150V; Features: Automotive AEC-Q200; Length: 2mm; Height: 0.45mm; Width: 1.25mm; Depth: 1.25mm; Radiation Hardening: No; Lead Free: Lead Free; REACH SVHC: Unknown; ComponentLink1URL: https://datasheet.ciiva.com/11811/0900766b80d98b26-11811304.pdf?src-supplier=RSComponents; ComponentLink1Description: https://datasheet.ciiva.com/11811/0900766b80d98b26-11811304.pdf?src-supplier=RSComponents; ComponentLink2URL: https://datasheet.ciiva.com/26314/fld-crcw-e3-data-en-26314630.pdf?src-supplier=Distrelec; ComponentLink2Description: https://datasheet.ciiva.com/26314/fld-crcw-e3-data-en-26314630.pdf?src-supplier=Distrelec; ComponentLink3URL: https://datasheet.ciiva.com/5543/dcrcwe3-109170-5543096.pdf?src-supplier=Mouser; ComponentLink3Description: https://datasheet.ciiva.com/5543/dcrcwe3-109170-5543096.pdf?src-supplier=Mouser; ComponentLink4URL: https://datasheet.ciiva.com/16389/dcrcwe3-16389338.pdf?src-supplier=Future+Electronics; ComponentLink4Description: https://datasheet.ciiva.com/16389/dcrcwe3-16389338.pdf?src-supplier=Future+Electronics; ComponentLink5URL: https://datasheet.ciiva.com/16719/70201119-16719706.pdf?src-supplier=Allied+Electronics; ComponentLink5Description: https://datasheet.ciiva.com/16719/70201119-16719706.pdf?src-supplier=Allied+Electronics; ComponentLink6URL: https://datasheet.ciiva.com/2463/dcrcwe3-2463037.pdf?src-supplier=Digi-Key; ComponentLink6Description: https://datasheet.ciiva.com/2463/dcrcwe3-2463037.pdf?src-supplier=Digi-Key; ComponentLink7URL: https://datasheet.ciiva.com/7841/1697337-7841629.pdf?src-supplier=Element14; ComponentLink7Description: https://datasheet.ciiva.com/7841/1697337-7841629.pdf?src-supplier=Element14; ComponentLink8URL: https://datasheet.ciiva.com/2463/dcrcwe3-2463038.pdf?src-supplier=Digi-Key; ComponentLink8Description: https://datasheet.ciiva.com/2463/dcrcwe3-2463038.pdf?src-supplier=Digi-Key; ComponentLink9URL: https://datasheet.ciiva.com/2463/dcrcwe3-2463039.pdf?src-supplier=Digi-Key; ComponentLink9Description: https://datasheet.ciiva.com/2463/dcrcwe3-2463039.pdf?src-supplier=Digi-Key; ComponentLink10URL: https://datasheet.ciiva.com/7841/1720486-7841839.pdf?src-supplier=Element14; ComponentLink10Description: https://datasheet.ciiva.com/7841/1720486-7841839.pdf?src-supplier=Element14; ComponentLink11URL: https://datasheet.ciiva.com/16883/dcrcwe3-16883622.pdf?src-supplier=Avnet+Europe; ComponentLink11Description: https://datasheet.ciiva.com/16883/dcrcwe3-16883622.pdf?src-supplier=Avnet+Europe
R36 = CMP-2001-00897-1: Manufacturer: Panasonic; Part Number: ERA6AEB9761V
R37-R39 R46-R48 = CMP-2001-03795-1: Manufacturer: Vishay Dale; Part Number: CRCW08052R70JNEA
R43-R45 = CMP-2000-03279-1: Manufacturer: Vishay Dale; Part Number: CRCW0603383KFKEA
R49-R51 = CMP-2000-04170-1: Manufacturer: Yageo; Part Number: RC0603FR-079K76L
TP1-TP6 = CMP-2000-05183-1: Test Point, White, SMT; Manufacturer: Keystone; Primary Type: PCBTestPoints; Style: Miniature; Finish Plating: SilverPlate; Material, Contact: PhosphorBronze; Material: PhosphorBronze; Datasheet URL: https://datasheet.ciiva.com/1123/5015-1123862.pdf; Thickness: 0.010In.; Manufacturer URL: http://www.keyelco.com/; Length: 0.105"(2.667mm); Datasheet Version: Mar-14; Contact Plating: Silver; Mounting Type: SurfaceMount; Termination: SMT; Type: TestPointsonTapeandReel; Height: 0.06In.; Mounting: SurfaceMount

## Nets that join several sheets
PGND: 02-Nucleo_Breakout (7 pins), 03-Gate_Driver (23 pins), 04-Power_Stage (22 pins)
VM: 03-Gate_Driver (5 pins), 04-Power_Stage (22 pins)
VREF: 02-Nucleo_Breakout (U1.27), 03-Gate_Driver (7 pins)